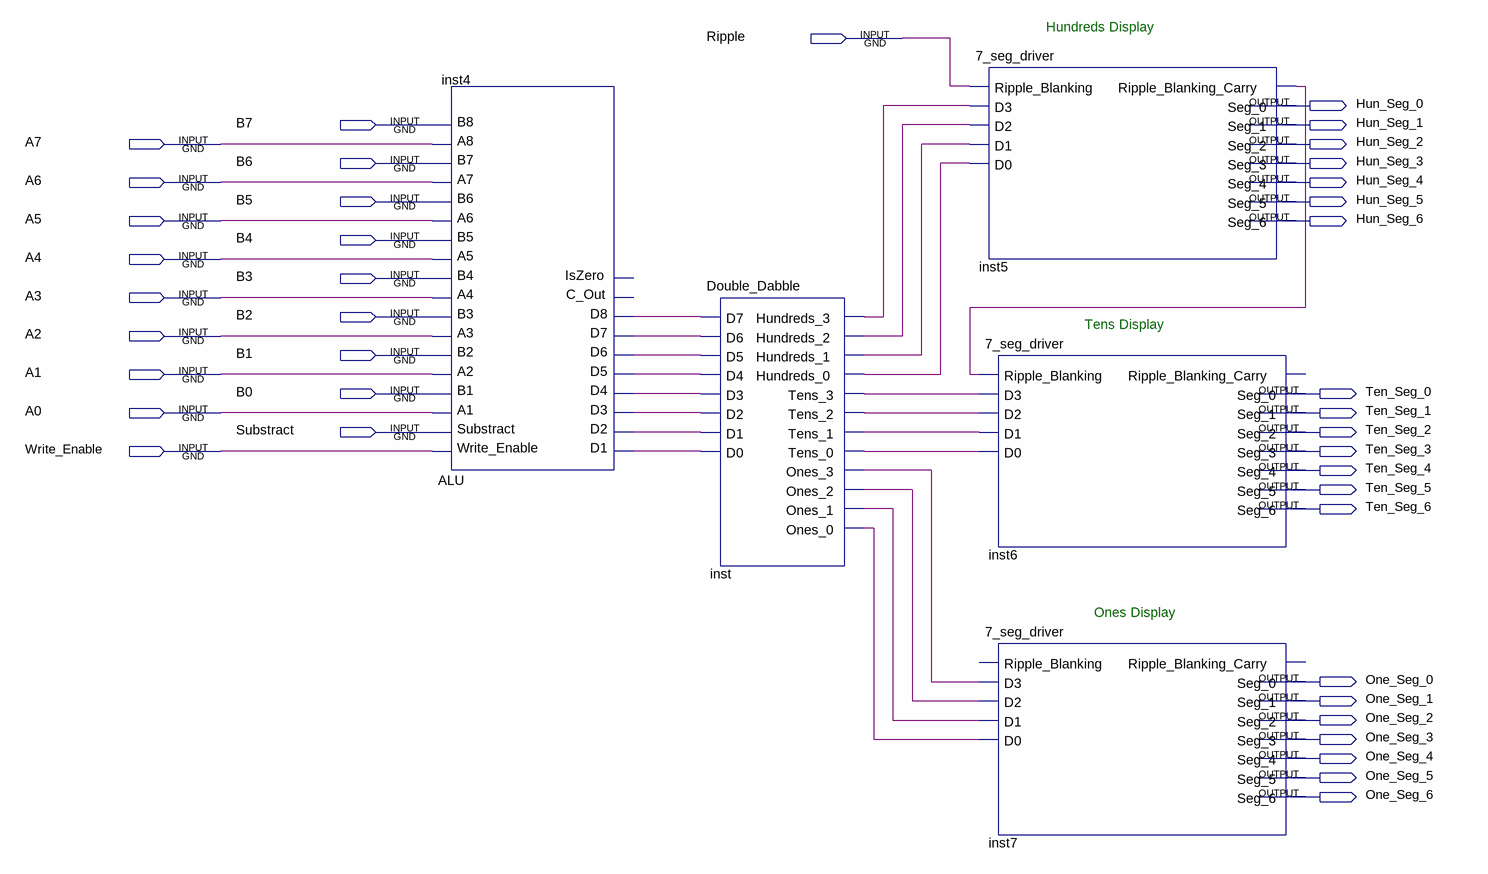
[diagram p0: schematic sheet]
// Quartus schematic doubleDabble_test.bdf as structural Verilog: 5 symbols, 40 pins
module doubleDabble_test (
  input  Ripple,
  input  B7,
  input  A7,
  input  B6,
  input  A6,
  input  B5,
  input  A5,
  input  B4,
  input  A4,
  input  B3,
  input  A3,
  input  B2,
  input  A2,
  input  B1,
  input  A1,
  input  B0,
  input  A0,
  input  Substract,
  input  Write_Enable,
  output Hun_Seg_0,
  output Hun_Seg_1,
  output Hun_Seg_2,
  output Hun_Seg_3,
  output Hun_Seg_4,
  output Hun_Seg_5,
  output Hun_Seg_6,
  output Ten_Seg_0,
  output Ten_Seg_1,
  output Ten_Seg_2,
  output Ten_Seg_3,
  output Ten_Seg_4,
  output Ten_Seg_5,
  output Ten_Seg_6,
  output One_Seg_0,
  output One_Seg_1,
  output One_Seg_2,
  output One_Seg_3,
  output One_Seg_4,
  output One_Seg_5,
  output One_Seg_6
);

  wire inst4_d1, inst4_d2, inst4_d3, inst4_d4, inst4_d5, inst4_d6, inst4_d7, inst4_d8,
       inst5_ripple_blanking_carry, inst_hundreds_0, inst_hundreds_1, inst_hundreds_2, inst_hundreds_3,
       inst_ones_0, inst_ones_1, inst_ones_2, inst_ones_3, inst_tens_0, inst_tens_1, inst_tens_2, inst_tens_3;

  ALU inst4 (
    .Write_Enable(Write_Enable), .Substract(Substract), .A1(A0), .B1(B0), .A2(A1), .B2(B1), .A3(A2), .B3(B2),
    .A4(A3), .B4(B3), .A5(A4), .B5(B4), .A6(A5), .B6(B5), .A7(A6), .B7(B6), .A8(A7), .B8(B7), .D1(inst4_d1),
    .D2(inst4_d2), .D3(inst4_d3), .D4(inst4_d4), .D5(inst4_d5), .D6(inst4_d6), .D7(inst4_d7), .D8(inst4_d8));  // open: C_Out, IsZero
  Double_Dabble inst (
    .D7(inst4_d8), .D6(inst4_d7), .D5(inst4_d6), .D4(inst4_d5), .D3(inst4_d4), .D2(inst4_d3), .D1(inst4_d2),
    .D0(inst4_d1), .Hundreds_3(inst_hundreds_3), .Hundreds_2(inst_hundreds_2), .Hundreds_1(inst_hundreds_1),
    .Hundreds_0(inst_hundreds_0), .Tens_3(inst_tens_3), .Tens_2(inst_tens_2), .Tens_1(inst_tens_1),
    .Tens_0(inst_tens_0), .Ones_3(inst_ones_3), .Ones_2(inst_ones_2), .Ones_1(inst_ones_1),
    .Ones_0(inst_ones_0));
  \7_seg_driver  inst5 (
    .Ripple_Blanking(Ripple), .D3(inst_hundreds_3), .D2(inst_hundreds_2), .D1(inst_hundreds_1),
    .D0(inst_hundreds_0), .Ripple_Blanking_Carry(inst5_ripple_blanking_carry));  // open: Seg_0, Seg_1, Seg_2, Seg_3, Seg_4, Seg_5, Seg_6
  \7_seg_driver  inst6 (
    .Ripple_Blanking(inst5_ripple_blanking_carry), .D3(inst_tens_3), .D2(inst_tens_2), .D1(inst_tens_1),
    .D0(inst_tens_0));  // open: Ripple_Blanking_Carry, Seg_0, Seg_1, Seg_2, Seg_3, Seg_4, Seg_5, Seg_6
  \7_seg_driver  inst7 (
    .D3(inst_ones_3), .D2(inst_ones_2), .D1(inst_ones_1), .D0(inst_ones_0));  // open: Ripple_Blanking, Ripple_Blanking_Carry, Seg_0, Seg_1, Seg_2, Seg_3, Seg_4, Seg_5, Seg_6

  // Notes on the sheet:
  //   Hundreds Display
  //   Tens Display
  //   Ones Display
endmodule
